# Altium schematic sheet 14-DPLL-03.SchDoc
size B; SheetNumber: 14; SheetTotal: 16
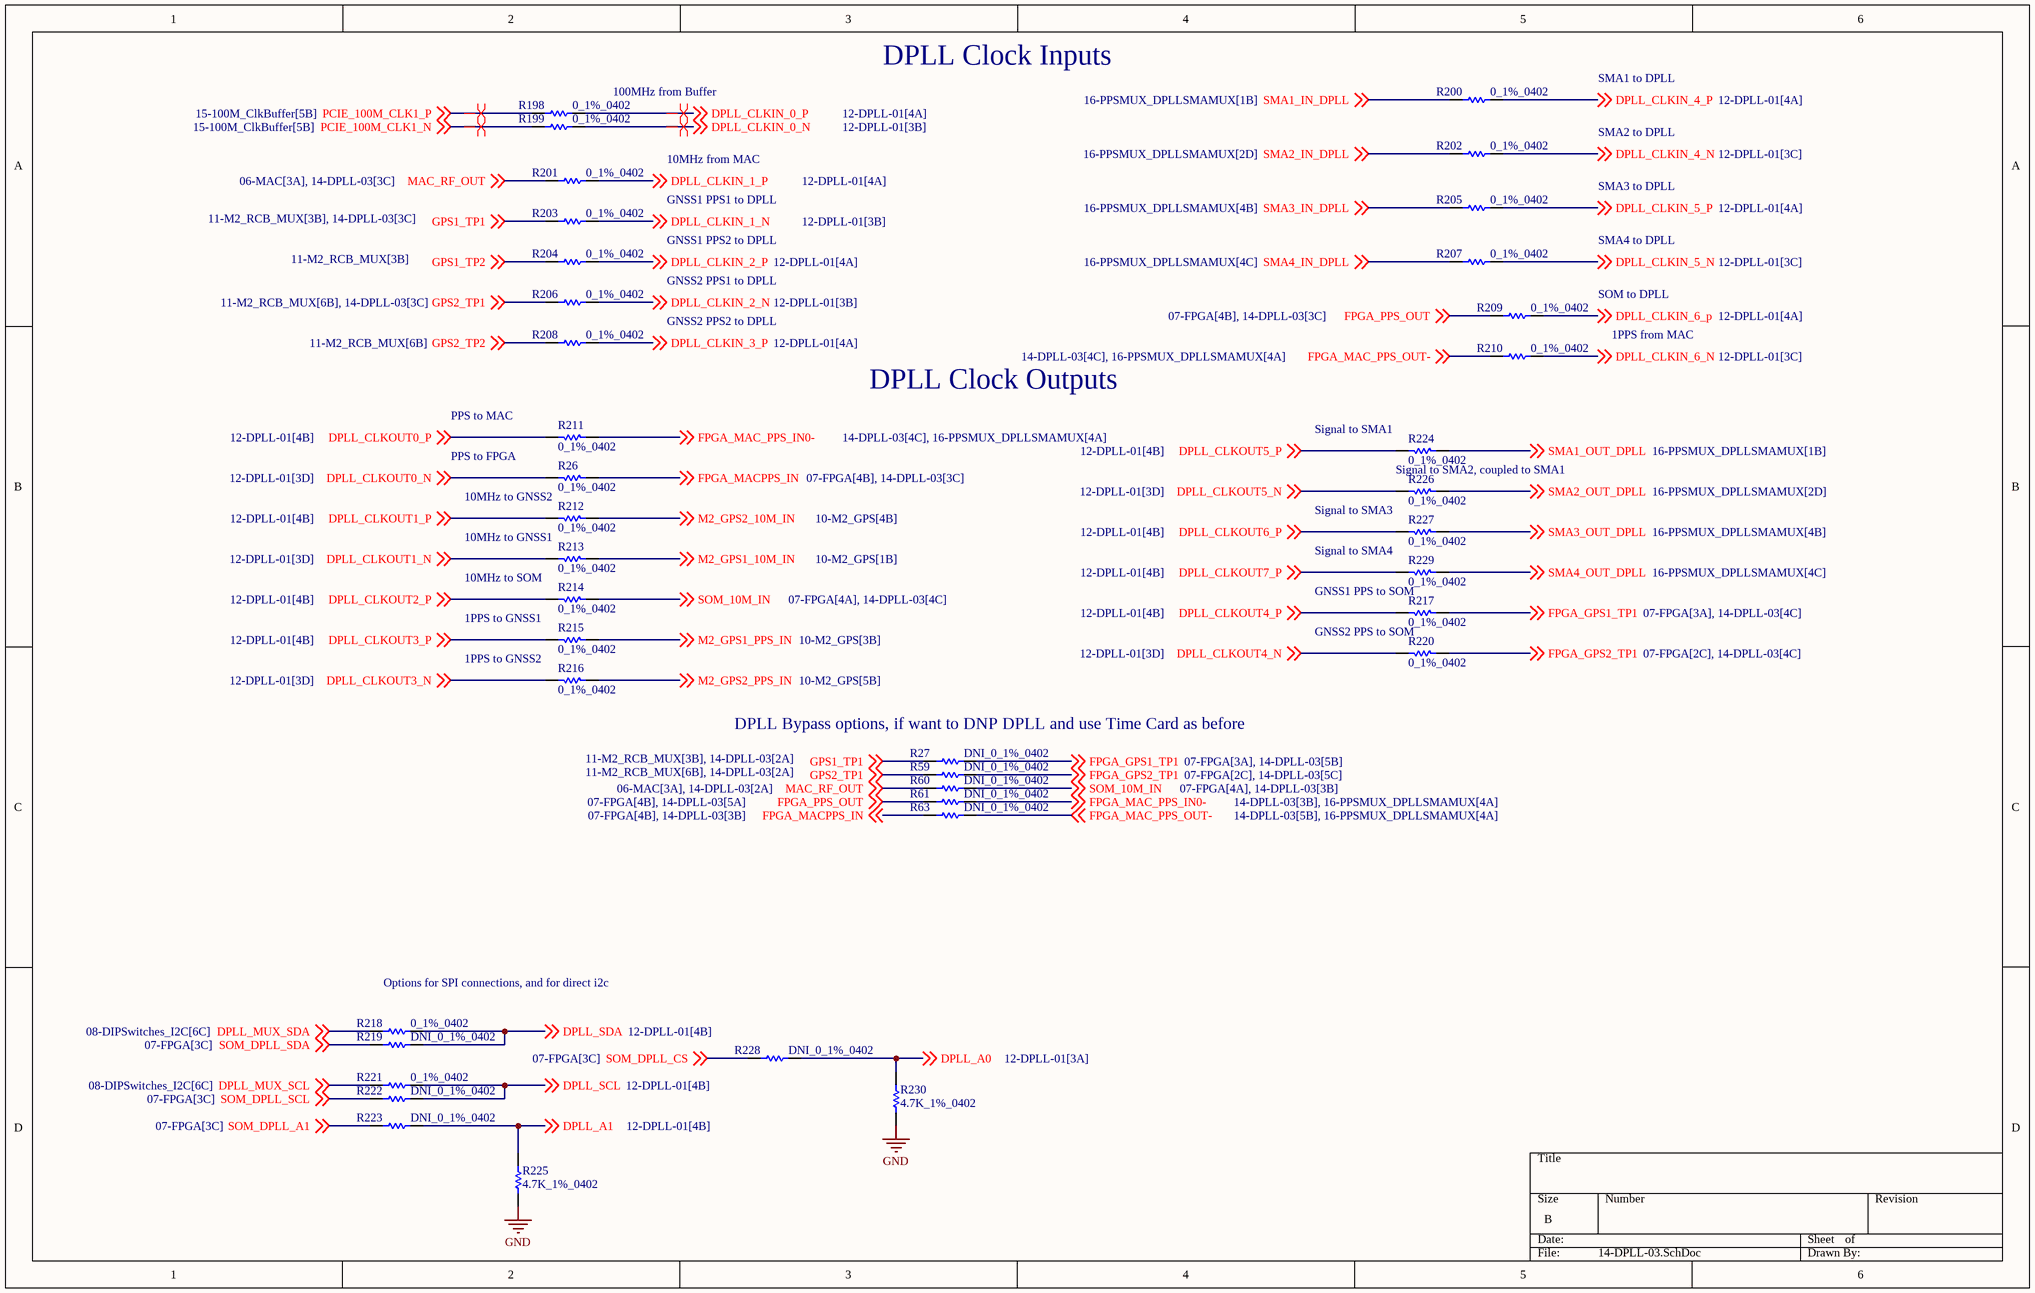
[diagram p0: 14-DPLL-03.SchDoc]

## Parts
R26  0_1%_0402  [RESC1005X40X25LL05T05]
R27  DNI_0_1%_0402  [RESC1005X40X25LL05T05]  (no BOM)
R59  DNI_0_1%_0402  [RESC1005X40X25LL05T05]  (no BOM)
R60  DNI_0_1%_0402  [RESC1005X40X25LL05T05]  (no BOM)
R61  DNI_0_1%_0402  [RESC1005X40X25LL05T05]  (no BOM)
R63  DNI_0_1%_0402  [RESC1005X40X25LL05T05]  (no BOM)
R198  0_1%_0402  [RESC1005X40X25LL05T05]
R199  0_1%_0402  [RESC1005X40X25LL05T05]
R200  0_1%_0402  [RESC1005X40X25LL05T05]
R201  0_1%_0402  [RESC1005X40X25LL05T05]
R202  0_1%_0402  [RESC1005X40X25LL05T05]
R203  0_1%_0402  [RESC1005X40X25LL05T05]
R204  0_1%_0402  [RESC1005X40X25LL05T05]
R205  0_1%_0402  [RESC1005X40X25LL05T05]
R206  0_1%_0402  [RESC1005X40X25LL05T05]
R207  0_1%_0402  [RESC1005X40X25LL05T05]
R208  0_1%_0402  [RESC1005X40X25LL05T05]
R209  0_1%_0402  [RESC1005X40X25LL05T05]
R210  0_1%_0402  [RESC1005X40X25LL05T05]
R211  0_1%_0402  [RESC1005X40X25LL05T05]
R212  0_1%_0402  [RESC1005X40X25LL05T05]
R213  0_1%_0402  [RESC1005X40X25LL05T05]
R214  0_1%_0402  [RESC1005X40X25LL05T05]
R215  0_1%_0402  [RESC1005X40X25LL05T05]
R216  0_1%_0402  [RESC1005X40X25LL05T05]
R217  0_1%_0402  [RESC1005X40X25LL05T05]
R218  0_1%_0402  [RESC1005X40X25LL05T05]
R219  DNI_0_1%_0402  [RESC1005X40X25LL05T05]  (no BOM)
R220  0_1%_0402  [RESC1005X40X25LL05T05]
R221  0_1%_0402  [RESC1005X40X25LL05T05]
R222  DNI_0_1%_0402  [RESC1005X40X25LL05T05]  (no BOM)
R223  DNI_0_1%_0402  [RESC1005X40X25LL05T05]  (no BOM)
R224  0_1%_0402  [RESC1005X40X25LL05T05]
R225  4.7K_1%_0402  [RESC1005X40X25NL10T10]
R226  0_1%_0402  [RESC1005X40X25LL05T05]
R227  0_1%_0402  [RESC1005X40X25LL05T05]
R228  DNI_0_1%_0402  [RESC1005X40X25LL05T05]  (no BOM)
R229  0_1%_0402  [RESC1005X40X25LL05T05]
R230  4.7K_1%_0402  [RESC1005X40X25NL10T10]

## Nets
GND: R225.1 R230.1
DPLL_A0: R228.2 R230.2 ; off-sheet DPLL_A0
DPLL_A1: R223.2 R225.2 ; off-sheet DPLL_A1
DPLL_CLKIN_0_N: R199.2 ; off-sheet DPLL_CLKIN_0_N
DPLL_CLKIN_0_P: R198.2 ; off-sheet DPLL_CLKIN_0_P
DPLL_CLKIN_1_N: R203.2 ; off-sheet DPLL_CLKIN_1_N
DPLL_CLKIN_1_P: R201.2 ; off-sheet DPLL_CLKIN_1_P
DPLL_CLKIN_2_N: R206.2 ; off-sheet DPLL_CLKIN_2_N
DPLL_CLKIN_2_P: R204.2 ; off-sheet DPLL_CLKIN_2_P
DPLL_CLKIN_3_P: R208.2 ; off-sheet DPLL_CLKIN_3_P
DPLL_CLKIN_4_N: R202.2 ; off-sheet DPLL_CLKIN_4_N
DPLL_CLKIN_4_P: R200.2 ; off-sheet DPLL_CLKIN_4_P
DPLL_CLKIN_5_N: R207.2 ; off-sheet DPLL_CLKIN_5_N
DPLL_CLKIN_5_P: R205.2 ; off-sheet DPLL_CLKIN_5_P
DPLL_CLKIN_6_N: R210.2 ; off-sheet DPLL_CLKIN_6_N
DPLL_CLKIN_6_p: R209.2 ; off-sheet DPLL_CLKIN_6_p
DPLL_CLKOUT0_N: R26.2 ; off-sheet DPLL_CLKOUT0_N
DPLL_CLKOUT0_P: R211.2 ; off-sheet DPLL_CLKOUT0_P
DPLL_CLKOUT1_N: R213.2 ; off-sheet DPLL_CLKOUT1_N
DPLL_CLKOUT1_P: R212.2 ; off-sheet DPLL_CLKOUT1_P
DPLL_CLKOUT2_P: R214.2 ; off-sheet DPLL_CLKOUT2_P
DPLL_CLKOUT3_N: R216.2 ; off-sheet DPLL_CLKOUT3_N
DPLL_CLKOUT3_P: R215.2 ; off-sheet DPLL_CLKOUT3_P
DPLL_CLKOUT4_N: R220.2 ; off-sheet DPLL_CLKOUT4_N
DPLL_CLKOUT4_P: R217.2 ; off-sheet DPLL_CLKOUT4_P
DPLL_CLKOUT5_N: R226.2 ; off-sheet DPLL_CLKOUT5_N
DPLL_CLKOUT5_P: R224.2 ; off-sheet DPLL_CLKOUT5_P
DPLL_CLKOUT6_P: R227.2 ; off-sheet DPLL_CLKOUT6_P
DPLL_CLKOUT7_P: R229.2 ; off-sheet DPLL_CLKOUT7_P
DPLL_MUX_SCL: R221.1 ; off-sheet DPLL_MUX_SCL
DPLL_MUX_SDA: R218.1 ; off-sheet DPLL_MUX_SDA
DPLL_SCL: R221.2 R222.2 ; off-sheet DPLL_SCL
DPLL_SDA: R218.2 R219.2 ; off-sheet DPLL_SDA
FPGA_GPS1_TP1: R27.2 R217.1 ; off-sheet FPGA_GPS1_TP1
FPGA_GPS2_TP1: R59.2 R220.1 ; off-sheet FPGA_GPS2_TP1
FPGA_MAC_PPS_IN0-: R61.2 R211.1 ; off-sheet FPGA_MAC_PPS_IN0-
FPGA_MAC_PPS_OUT-: R63.2 R210.1 ; off-sheet FPGA_MAC_PPS_OUT-
FPGA_MACPPS_IN: R26.1 R63.1 ; off-sheet FPGA_MACPPS_IN
FPGA_PPS_OUT: R61.1 R209.1 ; off-sheet FPGA_PPS_OUT
GPS1_TP1: R27.1 R203.1 ; off-sheet GPS1_TP1
GPS1_TP2: R204.1 ; off-sheet GPS1_TP2
GPS2_TP1: R59.1 R206.1 ; off-sheet GPS2_TP1
GPS2_TP2: R208.1 ; off-sheet GPS2_TP2
M2_GPS1_10M_IN: R213.1 ; off-sheet M2_GPS1_10M_IN
M2_GPS1_PPS_IN: R215.1 ; off-sheet M2_GPS1_PPS_IN
M2_GPS2_10M_IN: R212.1 ; off-sheet M2_GPS2_10M_IN
M2_GPS2_PPS_IN: R216.1 ; off-sheet M2_GPS2_PPS_IN
MAC_RF_OUT: R60.1 R201.1 ; off-sheet MAC_RF_OUT
PCIE_100M_CLK1_N: R199.1 ; off-sheet PCIE_100M_CLK1_N
PCIE_100M_CLK1_P: R198.1 ; off-sheet PCIE_100M_CLK1_P
SMA1_IN_DPLL: R200.1 ; off-sheet SMA1_IN_DPLL
SMA1_OUT_DPLL: R224.1 ; off-sheet SMA1_OUT_DPLL
SMA2_IN_DPLL: R202.1 ; off-sheet SMA2_IN_DPLL
SMA2_OUT_DPLL: R226.1 ; off-sheet SMA2_OUT_DPLL
SMA3_IN_DPLL: R205.1 ; off-sheet SMA3_IN_DPLL
SMA3_OUT_DPLL: R227.1 ; off-sheet SMA3_OUT_DPLL
SMA4_IN_DPLL: R207.1 ; off-sheet SMA4_IN_DPLL
SMA4_OUT_DPLL: R229.1 ; off-sheet SMA4_OUT_DPLL
SOM_10M_IN: R60.2 R214.1 ; off-sheet SOM_10M_IN
SOM_DPLL_A1: R223.1 ; off-sheet SOM_DPLL_A1
SOM_DPLL_CS: R228.1 ; off-sheet SOM_DPLL_CS
SOM_DPLL_SCL: R222.1 ; off-sheet SOM_DPLL_SCL
SOM_DPLL_SDA: R219.1 ; off-sheet SOM_DPLL_SDA

## Layout directives
differential pair: DPLL_CLKIN_0_N, DPLL_CLKIN_0_P, PCIE_100M_CLK1_N, PCIE_100M_CLK1_P

## Notes on the sheet
- 100MHz from Buffer
- DPLL Clock Inputs
- SMA1 to DPLL
- 10MHz from MAC
- SMA2 to DPLL
- GNSS1 PPS1 to DPLL
- SMA3 to DPLL
- GNSS1 PPS2 to DPLL
- GNSS2 PPS1 to DPLL
- SMA4 to DPLL
- SOM to DPLL
- GNSS2 PPS2 to DPLL
- 1PPS from MAC
- PPS to MAC
- DPLL Clock Outputs
- Signal to SMA1
- PPS to FPGA
- 10MHz to GNSS2
- Signal to SMA2, coupled to SMA1
- 10MHz to GNSS1
- Signal to SMA3
- Signal to SMA4
- 1PPS to GNSS1
- 10MHz to SOM
- GNSS1 PPS to SOM
- GNSS2 PPS to SOM
- 1PPS to GNSS2
- DPLL Bypass options, if want to DNP DPLL and use Time Card as before
- Options for SPI connections, and for direct i2c

## Library data of the parts
R26 R27 R59-R61 R63 R198-R224 R226-R229 = CMP-2000-07451-1: Chip Resistor, 0 Ohm, 0.1 W, -55 to 155 degC, 0402 (1005 Metric), RoHS, Tape and Reel; Manufacturer: Panasonic; Voltage Rating (DC): 50V; Temperature Coefficient: 600ppm/��C; Max Power Dissipation: 100mW; Resistance: 0mOhm; Tolerance: 5%; Number of Terminations: 2; Mount: SurfaceMount; Height: 0.35mm; Packaging: TapeandReel; Contact Plating: Tin; Manufacturer URL: http://www.panasonic.com/; Composition: ThickFilm; Max Operating Temperature: 155degC; REACH SVHC: NoSVHC; Case/Package: 0402; Package Reference: 402; Depth: 0.5mm; Package Description: 2-Pin Surface Mount Device, Body 1 x 0.5 mm; Datasheet URL: https://industrial.panasonic.com/cdbs/www-data/pdf/RDA0000/AOA0000C301.pdf; RoHSCompliant: True; Case Code (Imperial): 0402; Military Standard: Not; Min Operating Temperature: -55degC; Power Rating: 100mW; Datasheet Version: 03/2015; Length: 1mm; Case Code (Metric): 1005; Termination: SMD/SMT; Mounting Technology: SurfaceMount; Voltage Rating: 50V; Width: 0.02inch; Package Quantity: 1; Lead Free: LeadFree; Radiation Hardening: No
R225 R230 = CMP-2002-05217-1: Manufacturer: Bourns; Part Number: CR0402-FX-4701GLF